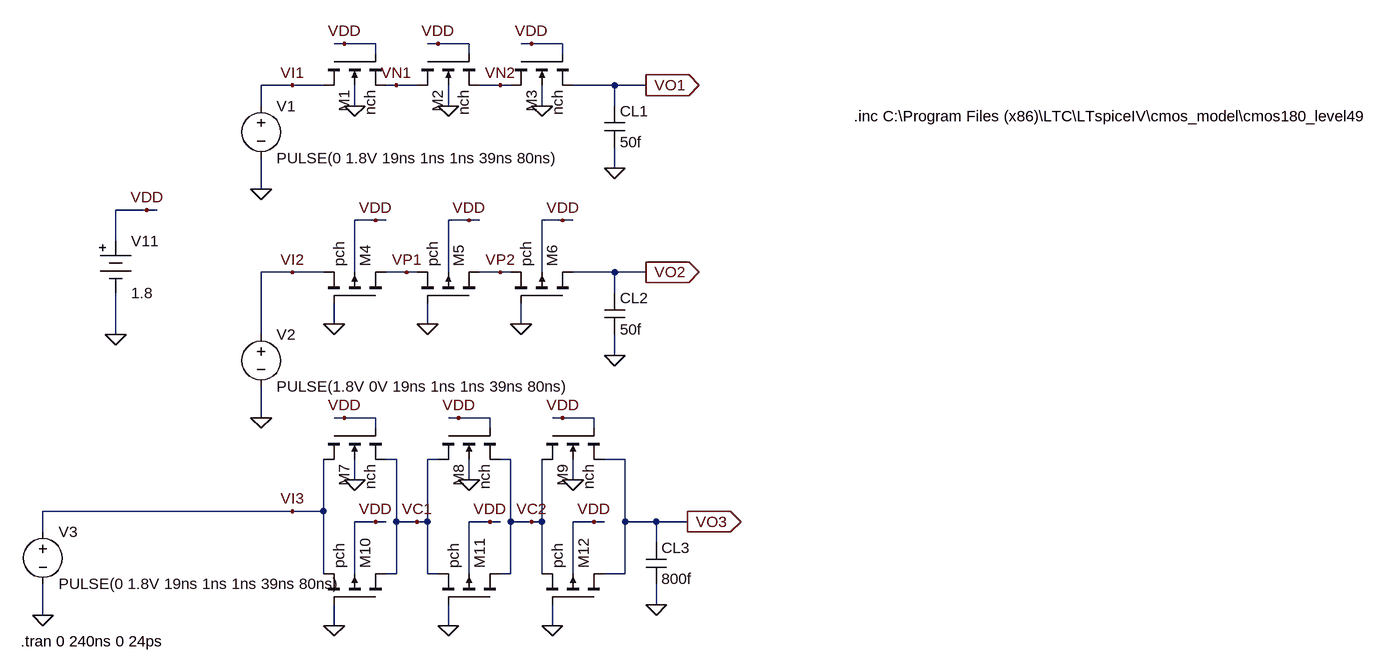
[diagram p0: schematic lab1.asc]
lab1.asc, the LTspice schematic file:
Version 4
SHEET 1 2220 948
WIRE 496 -160 480 -160
WIRE 544 -160 496 -160
WIRE 640 -160 624 -160
WIRE 688 -160 640 -160
WIRE 784 -160 768 -160
WIRE 832 -160 784 -160
WIRE 544 -144 544 -160
WIRE 688 -144 688 -160
WIRE 832 -144 832 -160
WIRE 416 -96 368 -96
WIRE 464 -96 416 -96
WIRE 576 -96 560 -96
WIRE 608 -96 576 -96
WIRE 736 -96 704 -96
WIRE 752 -96 736 -96
WIRE 912 -96 848 -96
WIRE 960 -96 912 -96
WIRE 368 -64 368 -96
WIRE 512 -64 512 -96
WIRE 656 -64 656 -96
WIRE 800 -64 800 -96
WIRE 912 -64 912 -96
WIRE 912 32 912 0
WIRE 368 64 368 16
WIRE 192 96 144 96
WIRE 208 96 192 96
WIRE 544 112 512 112
WIRE 560 112 544 112
WIRE 688 112 656 112
WIRE 704 112 688 112
WIRE 832 112 800 112
WIRE 848 112 832 112
WIRE 144 144 144 96
WIRE 416 192 368 192
WIRE 464 192 416 192
WIRE 512 192 512 112
WIRE 592 192 560 192
WIRE 608 192 592 192
WIRE 656 192 656 112
WIRE 736 192 704 192
WIRE 752 192 736 192
WIRE 800 192 800 112
WIRE 912 192 848 192
WIRE 960 192 912 192
WIRE 912 224 912 192
WIRE 480 272 480 240
WIRE 624 272 624 240
WIRE 768 272 768 240
WIRE 144 288 144 224
WIRE 368 288 368 192
WIRE 912 320 912 288
WIRE 368 416 368 368
WIRE 496 416 480 416
WIRE 544 416 496 416
WIRE 672 416 656 416
WIRE 720 416 672 416
WIRE 832 416 816 416
WIRE 880 416 832 416
WIRE 544 432 544 416
WIRE 720 432 720 416
WIRE 880 432 880 416
WIRE 576 480 560 480
WIRE 640 480 624 480
WIRE 752 480 736 480
WIRE 928 480 896 480
WIRE 512 512 512 480
WIRE 688 512 688 480
WIRE 848 512 848 480
WIRE 416 560 32 560
WIRE 464 560 464 480
WIRE 464 560 416 560
WIRE 544 576 512 576
WIRE 560 576 544 576
WIRE 576 576 576 480
WIRE 608 576 576 576
WIRE 624 576 624 480
WIRE 624 576 608 576
WIRE 720 576 688 576
WIRE 736 576 720 576
WIRE 752 576 752 480
WIRE 784 576 752 576
WIRE 800 576 800 480
WIRE 800 576 784 576
WIRE 880 576 848 576
WIRE 896 576 880 576
WIRE 928 576 928 480
WIRE 976 576 928 576
WIRE 1024 576 976 576
WIRE 32 592 32 560
WIRE 976 608 976 576
WIRE 464 656 464 560
WIRE 512 656 512 576
WIRE 576 656 576 576
WIRE 576 656 560 656
WIRE 624 656 624 576
WIRE 640 656 624 656
WIRE 688 656 688 576
WIRE 752 656 752 576
WIRE 752 656 736 656
WIRE 800 656 800 576
WIRE 848 656 848 576
WIRE 928 656 928 576
WIRE 928 656 896 656
WIRE 976 704 976 672
WIRE 32 720 32 672
WIRE 480 736 480 704
WIRE 656 736 656 704
WIRE 816 736 816 704
FLAG 144 288 0
FLAG 192 96 VDD
FLAG 368 64 0
FLAG 496 -160 VDD
FLAG 960 -96 VO1
IOPIN 960 -96 Out
FLAG 368 416 0
FLAG 960 192 VO2
IOPIN 960 192 Out
FLAG 544 112 VDD
FLAG 688 112 VDD
FLAG 832 112 VDD
FLAG 480 272 0
FLAG 624 272 0
FLAG 768 272 0
FLAG 912 320 0
FLAG 912 32 0
FLAG 512 -64 0
FLAG 496 416 VDD
FLAG 672 416 VDD
FLAG 832 416 VDD
FLAG 1024 576 VO3
IOPIN 1024 576 Out
FLAG 544 576 VDD
FLAG 720 576 VDD
FLAG 880 576 VDD
FLAG 480 736 0
FLAG 656 736 0
FLAG 816 736 0
FLAG 976 704 0
FLAG 512 512 0
FLAG 688 512 0
FLAG 848 512 0
FLAG 640 -160 VDD
FLAG 656 -64 0
FLAG 784 -160 VDD
FLAG 800 -64 0
FLAG 32 720 0
FLAG 576 -96 VN1
FLAG 736 -96 VN2
FLAG 592 192 VP1
FLAG 736 192 VP2
FLAG 608 576 VC1
FLAG 784 576 VC2
FLAG 416 -96 VI1
FLAG 416 192 VI2
FLAG 416 560 VI3
SYMBOL Misc\\battery 144 128 R0
WINDOW 123 0 0 Left 2
WINDOW 39 0 0 Left 2
SYMATTR InstName V11
SYMATTR Value 1.8
SYMBOL voltage 368 -80 R0
WINDOW 123 0 0 Left 2
WINDOW 39 0 0 Left 2
SYMATTR InstName V1
SYMATTR Value PULSE(0 1.8V 19ns 1ns 1ns 39ns 80ns)
SYMBOL nmos4 464 -144 M90
SYMATTR InstName M1
SYMATTR Value nch
SYMATTR Value2 l=0.18u w=4u
SYMBOL cap 896 -64 R0
SYMATTR InstName CL1
SYMATTR Value 50f
SYMBOL voltage 368 272 R0
WINDOW 123 0 0 Left 2
WINDOW 39 0 0 Left 2
SYMATTR InstName V2
SYMATTR Value PULSE(1.8V 0V 19ns 1ns 1ns 39ns 80ns)
SYMBOL cap 896 224 R0
SYMATTR InstName CL2
SYMATTR Value 50f
SYMBOL pmos4 560 240 M270
SYMATTR InstName M4
SYMATTR Value pch
SYMATTR Value2 l=0.18u w=10u
SYMBOL pmos4 704 240 M270
SYMATTR InstName M5
SYMATTR Value pch
SYMATTR Value2 l=0.18u w=10u
SYMBOL pmos4 848 240 M270
SYMATTR InstName M6
SYMATTR Value pch
SYMATTR Value2 l=0.18u w=10u
SYMBOL nmos4 464 432 M90
SYMATTR InstName M7
SYMATTR Value nch
SYMATTR Value2 l=0.18u w=4u
SYMBOL nmos4 640 432 M90
SYMATTR InstName M8
SYMATTR Value nch
SYMATTR Value2 l=0.18u w=4u
SYMBOL nmos4 800 432 M90
SYMATTR InstName M9
SYMATTR Value nch
SYMATTR Value2 l=0.18u w=4u
SYMBOL cap 960 608 R0
SYMATTR InstName CL3
SYMATTR Value 800f
SYMBOL pmos4 560 704 M270
SYMATTR InstName M10
SYMATTR Value pch
SYMATTR Value2 l=0.18u w=10u
SYMBOL pmos4 736 704 M270
SYMATTR InstName M11
SYMATTR Value pch
SYMATTR Value2 l=0.18u w=10u
SYMBOL pmos4 896 704 M270
SYMATTR InstName M12
SYMATTR Value pch
SYMATTR Value2 l=0.18u w=10u
SYMBOL nmos4 608 -144 M90
SYMATTR InstName M2
SYMATTR Value nch
SYMATTR Value2 l=0.18u w=4u
SYMBOL nmos4 752 -144 M90
SYMATTR InstName M3
SYMATTR Value nch
SYMATTR Value2 l=0.18u w=4u
SYMBOL voltage 32 576 R0
WINDOW 123 0 0 Left 2
WINDOW 39 0 0 Left 2
SYMATTR InstName V3
SYMATTR Value PULSE(0 1.8V 19ns 1ns 1ns 39ns 80ns)
TEXT 1280 -48 Left 2 !.inc C:\\Program Files (x86)\\LTC\\LTspiceIV\\cmos_model\\cmos180_level49
TEXT -2 760 Left 2 !.tran 0 240ns 0 24ps

The netlist it stands for:
* lab1.asc
V11 VDD 0 1.8
V1 VI1 0 PULSE(0 1.8V 19ns 1ns 1ns 39ns 80ns)
M1 VI1 VDD VN1 0 nch l=0.18u w=4u
CL1 VO1 0 50f
V2 VI2 0 PULSE(1.8V 0V 19ns 1ns 1ns 39ns 80ns)
CL2 VO2 0 50f
M4 VP1 0 VI2 VDD pch l=0.18u w=10u
M5 VP2 0 VP1 VDD pch l=0.18u w=10u
M6 VO2 0 VP2 VDD pch l=0.18u w=10u
M7 VI3 VDD VC1 0 nch l=0.18u w=4u
M8 VC1 VDD VC2 0 nch l=0.18u w=4u
M9 VC2 VDD VO3 0 nch l=0.18u w=4u
CL3 VO3 0 800f
M10 VC1 0 VI3 VDD pch l=0.18u w=10u
M11 VC2 0 VC1 VDD pch l=0.18u w=10u
M12 VO3 0 VC2 VDD pch l=0.18u w=10u
M2 VN1 VDD VN2 0 nch l=0.18u w=4u
M3 VN2 VDD VO1 0 nch l=0.18u w=4u
V3 VI3 0 PULSE(0 1.8V 19ns 1ns 1ns 39ns 80ns)
.model NMOS NMOS
.model PMOS PMOS
.lib standard.mos
.inc C:\Program Files (x86)\LTC\LTspiceIV\cmos_model\cmos180_level49
.tran 0 240ns 0 24ps
.backanno
.end

* Results of the author's LTspice run, read from the files saved beside the schematic
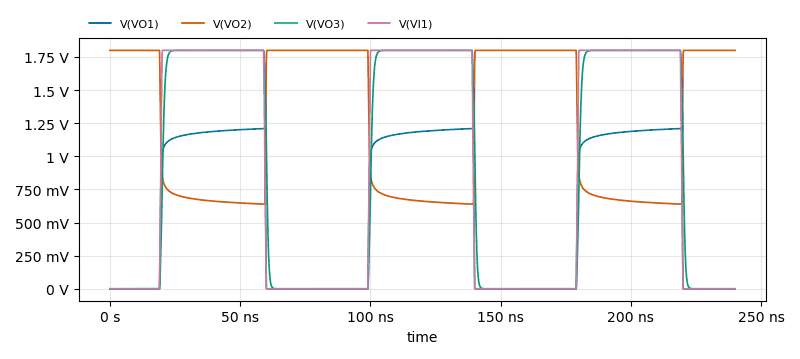
[diagram p1: Transient Analysis of lab1.asc, plotted from the saved traces]
* Transient Analysis, 1 run:
*   V(VO1): min 0 V, max 1.21 V, average 593.4 mV, rms 833.6 mV, last 0 V
*   V(VO2): min 638.7 mV, max 1.8 V, average 1.232 V, rms 1.353 V, last 1.8 V
*   V(VO3): min 0 V, max 1.8 V, average 898.4 mV, rms 1.259 V, last 0 V
*   V(VI1): min 0 V, max 1.8 V, average 900 mV, rms 1.267 V, last 0 V